# EasyEDA schematic Panasonic-Aquarea-ESP32_SCH_V3_8.json
TITLE: ESP32 Panasonic Aquarea Interface; REV: 2.0; Date: 2023-10-29; Sheet: 1/1; Drawn By: Krzysztof Sala; Company: none
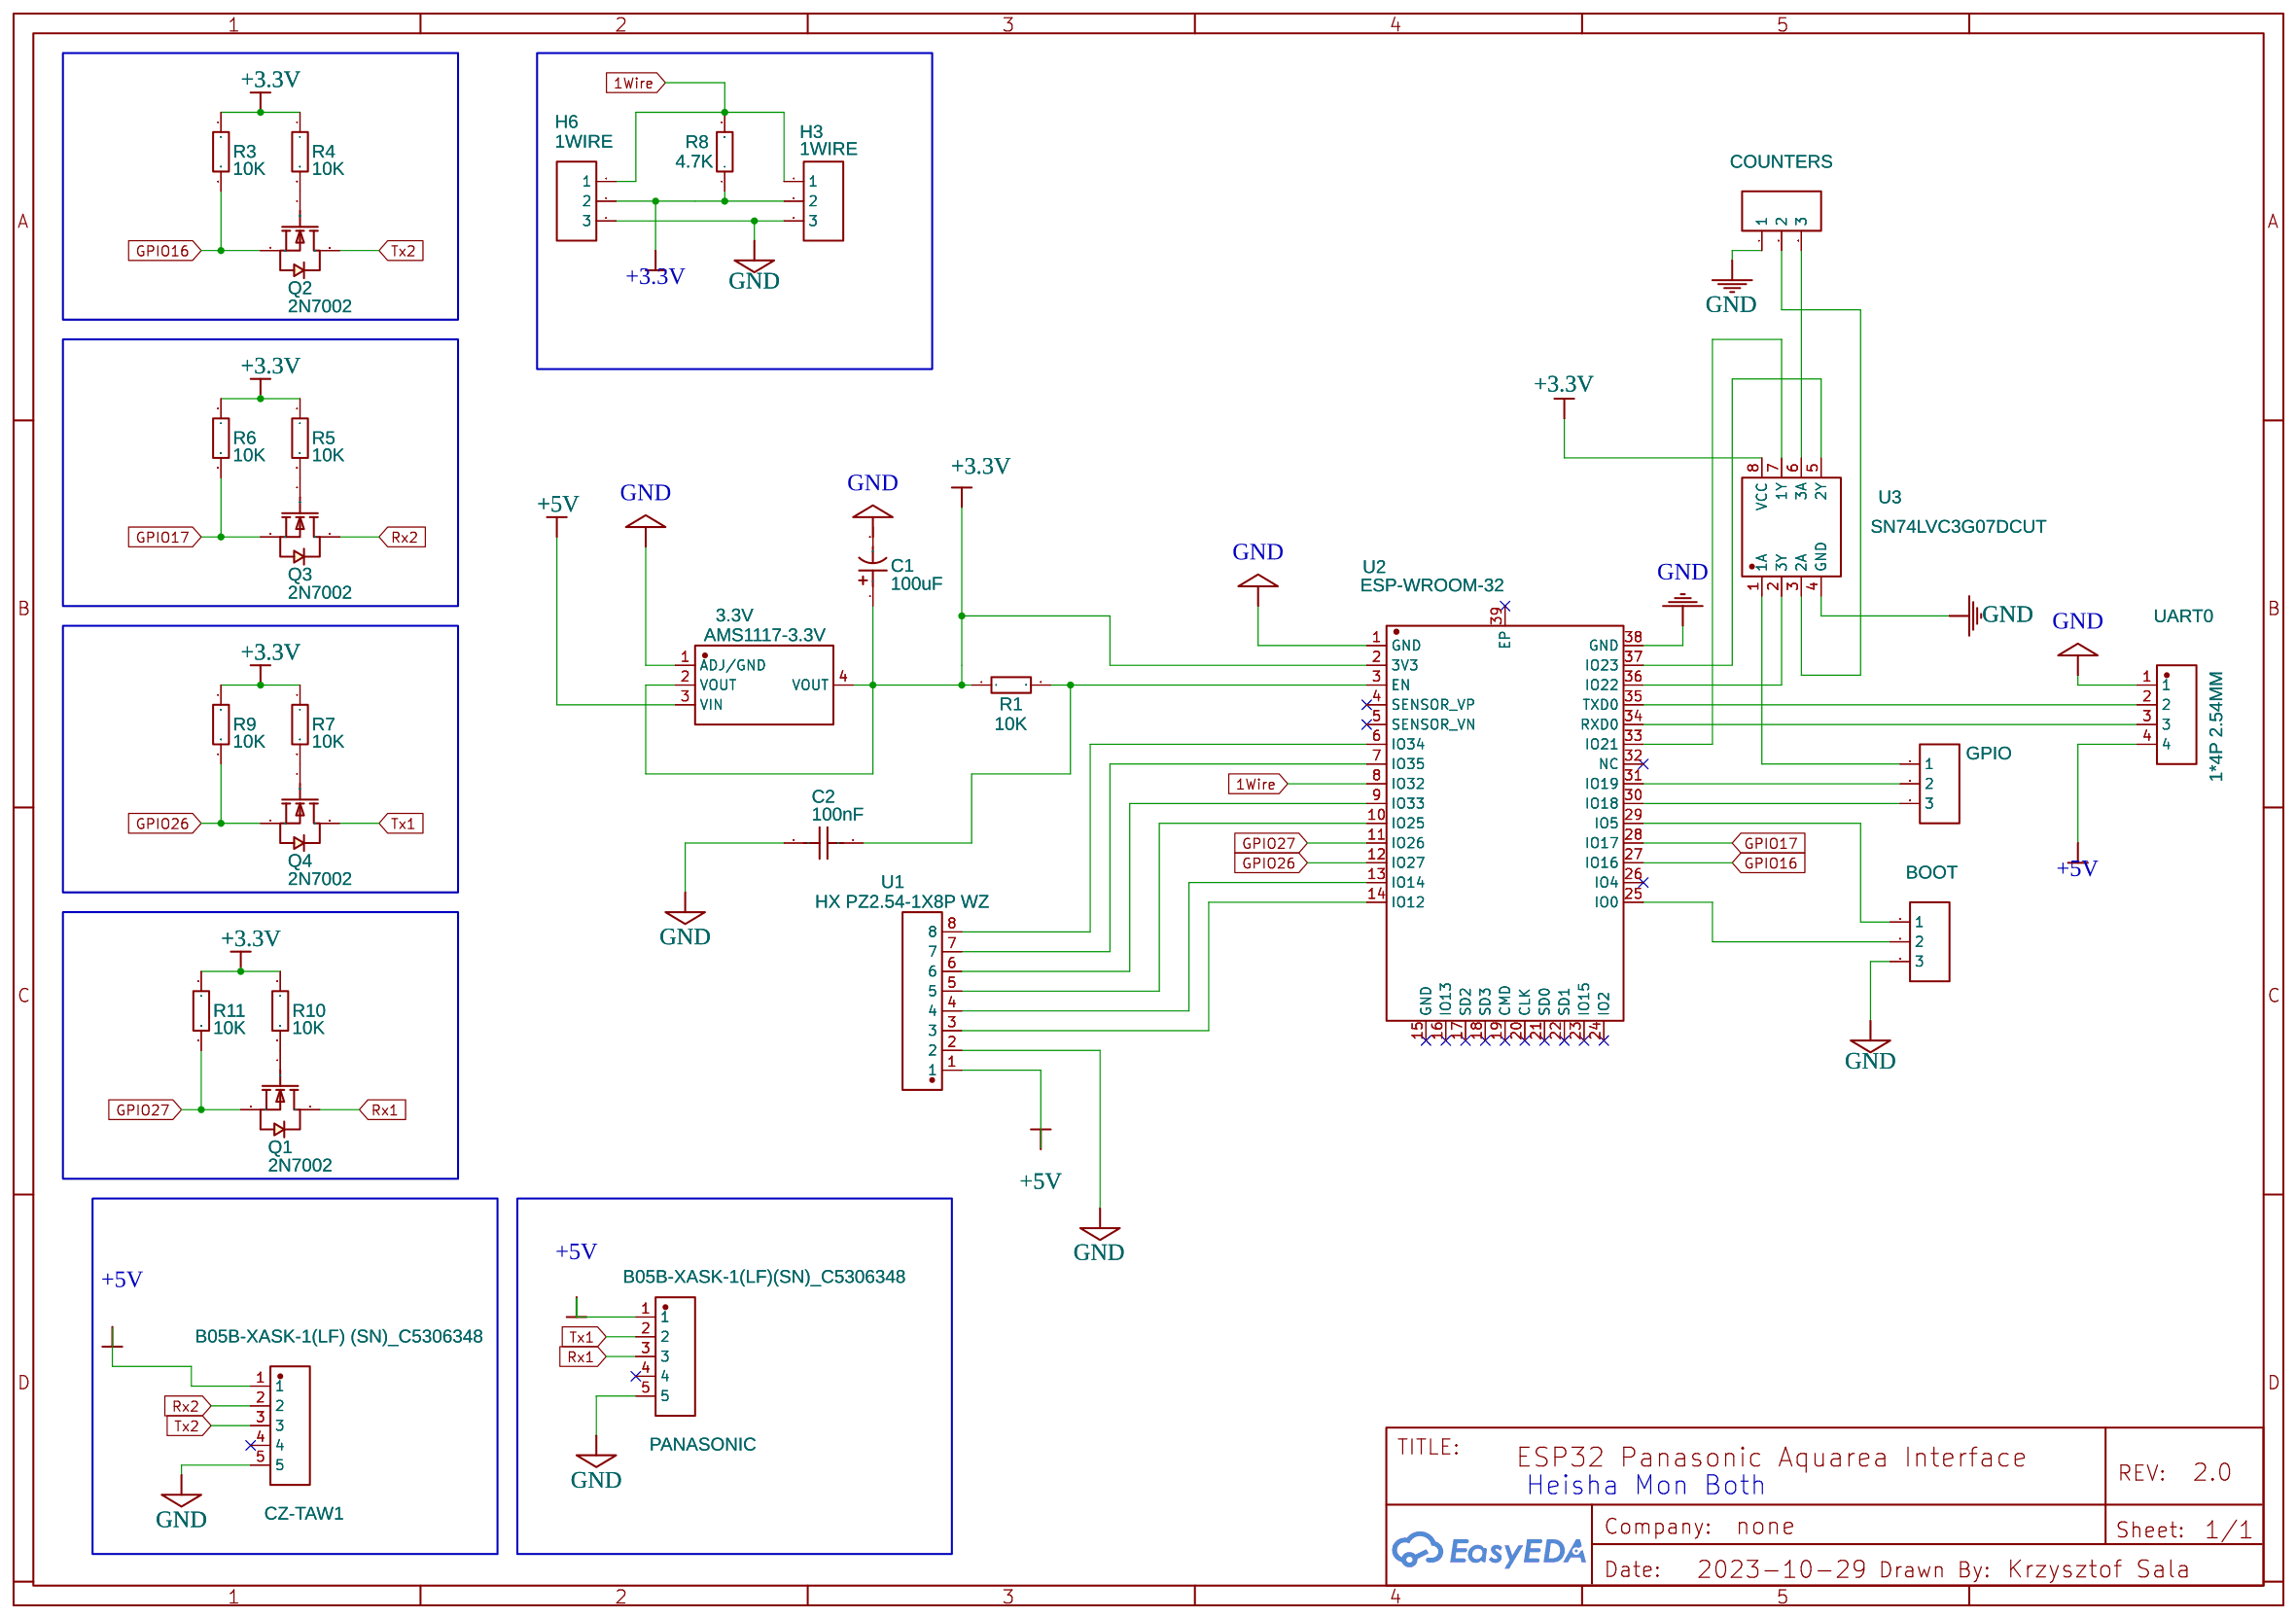
[diagram p0: schematic sheet]

## Parts
3.3V  AMS1117-3.3V  [SOT-223-4_L6.5-W3.5-P2.30-LS7.0-BR]
BOOT  S0 coounters  [HDR-TH_3P-P2.54-V]
C1  100uF  [CAP-SMD_L5.0-W2.5-FD]
C2  100nF  [C1206]
COUNTERS  S0 coounters  [HDR-TH_3P-P2.54-V]
CZ-TAW1  B05B-XASK-1(LF) (SN)_C5306348  [CONN-TH_B05B-XASK-1-LF-SN]
GPIO  S0 coounters  [HDR-TH_3P-P2.54-V]
H3  1WIRE  [HDR-TH_3P-P2.54-V]
H6  1WIRE  [HDR-TH_3P-P2.54-V]
PANASONIC  B05B-XASK-1(LF)(SN)_C5306348  [CONN-TH_B05B-XASK-1-LF-SN]
Q1  2N7002  [SOT-23(SOT-23-3)]
Q2  2N7002  [SOT-23(SOT-23-3)]
Q3  2N7002  [SOT-23(SOT-23-3)]
Q4  2N7002  [SOT-23(SOT-23-3)]
R1  10K  [R1206]
R3  10K  [R1206]
R4  10K  [R1206]
R5  10K  [R1206]
R6  10K  [R1206]
R7  10K  [R1206]
R8  4.7K  [R1206]
R9  10K  [R1206]
R10  10K  [R1206]
R11  10K  [R1206]
U1  HX PZ2.54-1X8P WZ  [HDR-TH_8P-P2.54-V-M_X6512WV-08H-C60D30-E100]
U2  ESP-WROOM-32  [WIFIM-SMD_ESP-WROOM-32]
U3  SN74LVC3G07DCUT  [SSOP-8_L3.0-W2.8-P0.65-LS4.0-BL]
UART0  1*4P 2.54MM  [HDR-TH_4P-P2.54-V-C4_TH-4_2.5X10.5X2.54P]

## Library data of the parts
3.3V = AMS1117-3.3V: Contributor: LCSC; Supplier: LCSC; Supplier Part: C2688239; Manufacturer: WPMtek(维攀微); JLCPCB Part Class: Extended Part; link: https://lcsc.com/eda_search?q=C2688239&%26type=1&ref=editor
BOOT COUNTERS GPIO H3 H6 = -: Supplier: LCSC; Manufacturer: BOOMELE; Manufacturer Part: Header2.54mm 1*3P; image: //image.lceda.cn/szlcsc/C49257.jpg; Supplier Part: C49257
C1 = HS1C107M0507PC: Supplier: LCSC; Supplier Part: C2895831; Manufacturer: HONOR(荣誉); link: https://atta.szlcsc.com/upload/public/pdf/source/20210928/03EF1DB68D9E7AA6E544095DEF5878B9.pdf; JLCPCB Part Class: Extended Part; Contributor: lcsc
C2 = GRM31C5C1E104JA01L_C426117: Supplier: LCSC; Supplier Part: C426117; Manufacturer: muRata(村田); Manufacturer Part: GRM31C5C1E104JA01L; Contributor: LCSC; JLCPCB Part Class: Extended Part
CZ-TAW1 PANASONIC = B05B-XASK-1(LF)(SN)_C5306348: Contributor: lcsc; Supplier: LCSC; Supplier Part: C5306348; Manufacturer: JST; Manufacturer Part: B05B-XASK-1(LF)(SN); link: https://lcsc.com/eda_search?q=C5306348&%26type=1&ref=editor
Q1-Q4 = -: Supplier: LCSC; Manufacturer: CJ; LCSC Assembly: Yes; image: //image.lceda.cn/szlcsc/C8545.jpg; Supplier Part: C8545; SMT Type: Basic
R1 R3-R7 R9-R11 = 0603WAF1002T5E: Supplier: LCSC; Manufacturer: UniOhm; LCSC Assembly: Yes; Supplier Part: C25804; SMT Type: Basic
R8 = 0603WAF4701T5E: Supplier: LCSC; Manufacturer: UniOhm; LCSC Assembly: Yes; Supplier Part: C23162; SMT Type: Basic
U1 = HX PZ2.54-1X8P WZ: Supplier: LCSC; Supplier Part: C32713267; Manufacturer: hanxia(韩下); Manufacturer Part: HX PZ2.54-1x8P WZ; Contributor: lcsc; JLCPCB Part Class: Extended Part
U2 = ESP-WROOM-32: Supplier: LCSC; Manufacturer: ESPRESSIF(乐鑫); Manufacturer Part: ESP32-WROOM-32; Supplier Part: C95209; JLCPCB Part Class: Extended Part
U3 = SN74LVC3G07DCUT: Contributor: LCSC; Supplier: LCSC; Supplier Part: C2676088; Manufacturer: TI(德州仪器); JLCPCB Part Class: Extended Part
UART0 = 1*4P 2.54MM: Contributor: LCSC; Supplier: LCSC; Supplier Part: C2887121; Manufacturer: null; Manufacturer Part: 单排直插排针 1*4P 2.54mm; JLCPCB Part Class: Extended Part; link: https://lcsc.com/eda_search?q=C2887121&%26type=1&ref=editor

## Nets
+3.3V: 3.3V.2(VOUT) 3.3V.4(VOUT) C1.1 H3.2 H6.2 R1.1 R3.1 R4.1 R5.1 R6.1 R7.1 R8.1 R9.1 R10.1 R11.1 U2.2(3V3) U3.8(VCC)
+5V: 3.3V.3(VIN) CZ-TAW1.1 PANASONIC.1 U1.1 UART0.4
GND: 3.3V.1(ADJ/GND) BOOT.3 C1.2 C2.2 COUNTERS.1 CZ-TAW1.5 H3.3 H6.3 PANASONIC.5 U1.2 U2.1(GND) U2.38(GND) U3.4(GND) UART0.1
1Wire: H3.1 H6.1 R8.2 U2.8(IO32)
GPIO16: Q2.2(S) R3.2 U2.27(IO16)
GPIO17: Q3.2(S) R6.2 U2.28(IO17)
GPIO26: Q4.2(S) R9.2 U2.12(IO27)
GPIO27: Q1.2(S) R11.2 U2.11(IO26)
Rx1: PANASONIC.3 Q1.3(D)
Rx2: CZ-TAW1.2 Q3.3(D)
Tx1: PANASONIC.2 Q4.3(D)
Tx2: CZ-TAW1.3 Q2.3(D)
Net-(BOOT-1): BOOT.1 U2.29(IO5)
Net-(BOOT-2): BOOT.2 U2.25(IO0)
Net-(C2-1): C2.1 R1.2 U2.3(EN)
Net-(COUNTERS-2): COUNTERS.2 U3.3(2A)
Net-(COUNTERS-3): COUNTERS.3 U3.6(3A)
Net-(GPIO-1): GPIO.1 U3.1(1A)
Net-(GPIO-2): GPIO.2 U2.31(IO19)
Net-(GPIO-3): GPIO.3 U2.30(IO18)
Net-(Q1-1): Q1.1(G) R10.2
Net-(Q2-1): Q2.1(G) R4.2
Net-(Q3-1): Q3.1(G) R5.2
Net-(Q4-1): Q4.1(G) R7.2
Net-(U1-3): U1.3 U2.14(IO12)
Net-(U1-4): U1.4 U2.13(IO14)
Net-(U1-5): U1.5 U2.10(IO25)
Net-(U1-6): U1.6 U2.9(IO33)
Net-(U1-7): U1.7 U2.7(IO35)
Net-(U1-8): U1.8 U2.6(IO34)
Net-(U2-33): U2.33(IO21) U3.7(1Y)
Net-(U2-34): U2.34(RXD0) UART0.3
Net-(U2-35): U2.35(TXD0) UART0.2
Net-(U2-36): U2.36(IO22) U3.2(3Y)
Net-(U2-37): U2.37(IO23) U3.5(2Y)

Not connected (* = marked no-connect by the designer): CZ-TAW1 4*; PANASONIC 4*; U2 4(SENSOR_VP)* 5(SENSOR_VN)* 15(GND)* 16(IO13)* 17(SD2)* 18(SD3)* 19(CMD)* 20(CLK)* 21(SD0)* 22(SD1)* 23(IO15)* 24(IO2)* 26(IO4)* 32(NC)* 39(EP)*

## Notes on the sheet
- Heisha Mon Both
